# Altium schematic sheet mcu.SchDoc
size A
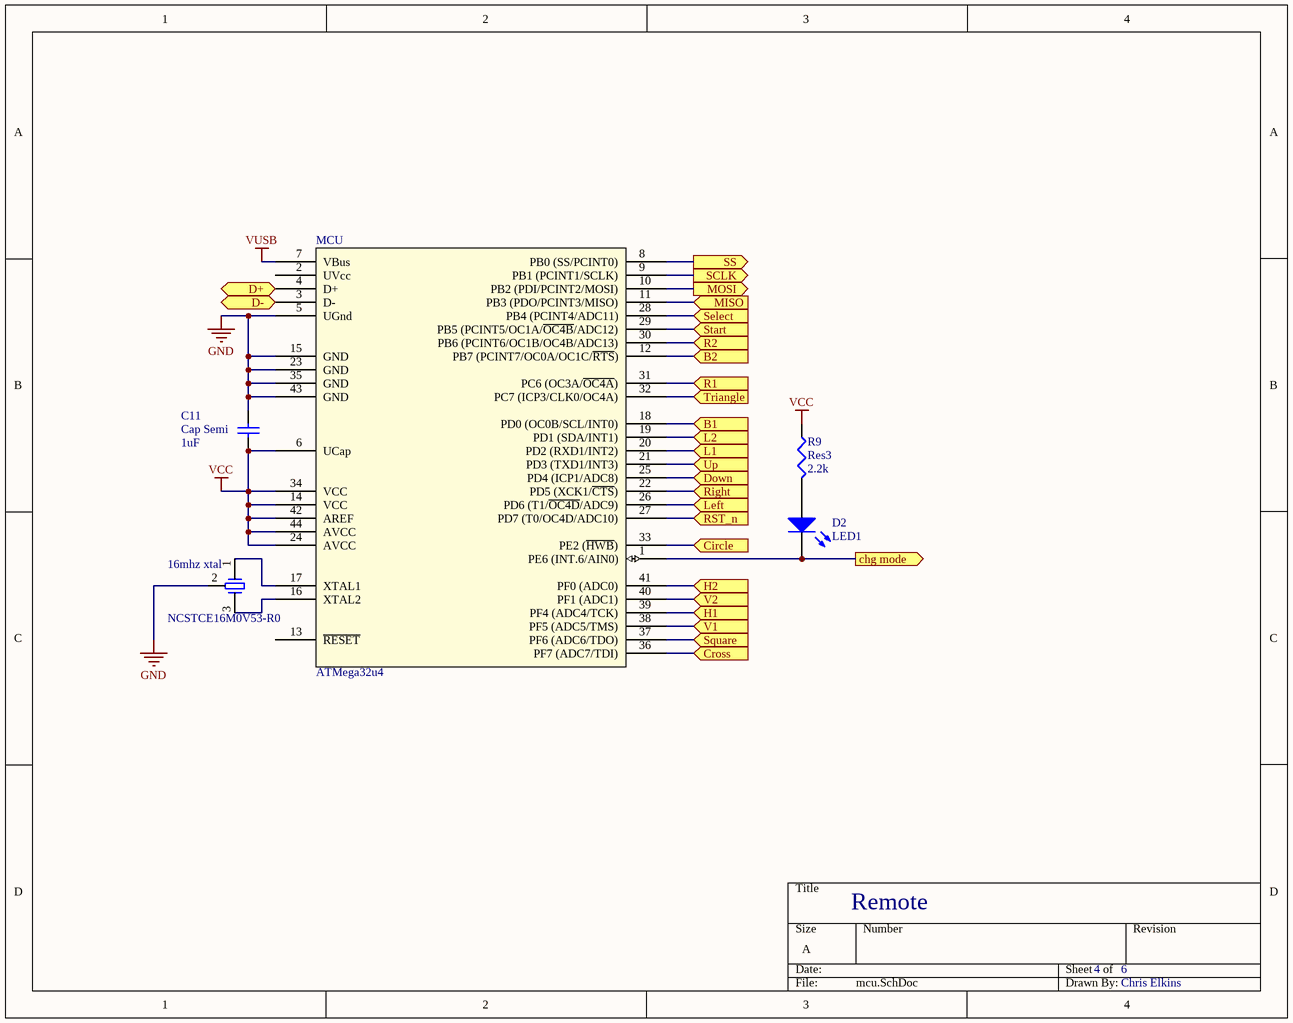
[diagram p0: mcu.SchDoc]

## Parts
16mhz_xtal  NCSTCE16M0V53-R0  [OSC]
C11  Cap Semi  value 1uF  [CAPC1608L]
D2  LED1  [LED-1]
MCU  ATMega32u4  [TQFP44_M]
R9  Res3  value 2.2k  [RESC1608L]

## Ports
B1 (in), B2 (in), chg mode (out), Circle (in), Cross (in), D+ (bidir), D- (bidir), Down (in), H1 (in), H2 (in), L1 (in), L2 (in), Left (in), MISO (in), MOSI (out), R1 (in), R2 (in), Right (in), RST_n (in), SCLK (out), Select (in), Square (in), SS (out), Start (in), Triangle (in), Up (in), V1 (in), V2 (in)

## Nets
GND: 16mhz_xtal.2 C11.2 MCU.5(UGnd) MCU.15(GND) MCU.23(GND) MCU.35(GND) MCU.43(GND)
VCC: C11.1 MCU.6(UCap) MCU.14(VCC) MCU.24(AVCC) MCU.34(VCC) MCU.42(AREF) MCU.44(AVCC) R9.1
VUSB: MCU.7(VBus)
B1: MCU.18(PD0_(OC0B/SCL/INT0)) ; port B1
B2: MCU.12(PB7_(PCINT7/OC0A/OC1C/~{RTS})) ; port B2
chg mode: D2.2(K) MCU.1(PE6_(INT.6/AIN0)) ; port chg mode
Circle: MCU.33(PE2_(~{HWB})) ; port Circle
Cross: MCU.36(PF7_(ADC7/TDI)) ; port Cross
D+: MCU.4(D+) ; port D+
D-: MCU.3(D-) ; port D-
Down: MCU.25(PD4_(ICP1/ADC8)) ; port Down
H1: MCU.39(PF4_(ADC4/TCK)) ; port H1
H2: MCU.41(PF0_(ADC0)) ; port H2
L1: MCU.20(PD2_(RXD1/INT2)) ; port L1
L2: MCU.19(PD1_(SDA/INT1)) ; port L2
Left: MCU.26(PD6_(T1/~{OC4D}/ADC9)) ; port Left
MISO: MCU.11(PB3_(PDO/PCINT3/MISO)) ; port MISO
MOSI: MCU.10(PB2_(PDI/PCINT2/MOSI)) ; port MOSI
R1: MCU.31(PC6_(OC3A/~{OC4A})) ; port R1
R2: MCU.30(PB6_(PCINT6/OC1B/OC4B/ADC13)) ; port R2
Right: MCU.22(PD5_(XCK1/~{CTS})) ; port Right
RST_n: MCU.27(PD7_(T0/OC4D/ADC10)) ; port RST_n
SCLK: MCU.9(PB1_(PCINT1/SCLK)) ; port SCLK
Select: MCU.28(PB4_(PCINT4/ADC11)) ; port Select
Square: MCU.37(PF6_(ADC6/TDO)) ; port Square
SS: MCU.8(PB0_(SS/PCINT0)) ; port SS
Start: MCU.29(PB5_(PCINT5/OC1A/~{OC4B}/ADC12)) ; port Start
Triangle: MCU.32(PC7_(ICP3/CLK0/OC4A)) ; port Triangle
Up: MCU.21(PD3_(TXD1/INT3)) ; port Up
V1: MCU.38(PF5_(ADC5/TMS)) ; port V1
V2: MCU.40(PF1_(ADC1)) ; port V2
Net16mhz_xtal_1: 16mhz_xtal.1 MCU.17(XTAL1)
Net16mhz_xtal_3: 16mhz_xtal.3 MCU.16(XTAL2)
NetD2_1: D2.1(A) R9.2

Not connected (* = marked no-connect by the designer): MCU 2(UVcc) 13(~{RESET})

## Notes on the sheet
- Remote
- 4
- 6
- Chris Elkins

## Library data of the parts
C11 = Cap Semi: Capacitor (Semiconductor SIM Model); Published: 8-Jun-2000; LatestRevisionDate: 29-May-2009; LatestRevisionNote: IPC-7351 Footprint Added.; PackageReference: C1206; Publisher: Altium Limited; PackageDescription: Chip Capacitor
D2 = LED1: Typical RED GaAs LED; Published: 8-Jun-2000; LatestRevisionDate: 08-Jul-2005; LatestRevisionNote: Mech Layer 1 removed.; PackageReference: LED-1; Publisher: Altium Limited
MCU = ATMega32u4: usb enabled avr microcontroller
R9 = Res3: Resistor; Published: 8-Jun-2000; LatestRevisionDate: 29-May-2009; LatestRevisionNote: IPC-7351 Footprint Added.; PackageReference: J1-0603; Publisher: Altium Limited; PackageDescription: Chip Resistor